# Altium schematic sheet Power.SchDoc
size B; SheetNumber: 2; SheetTotal: 7
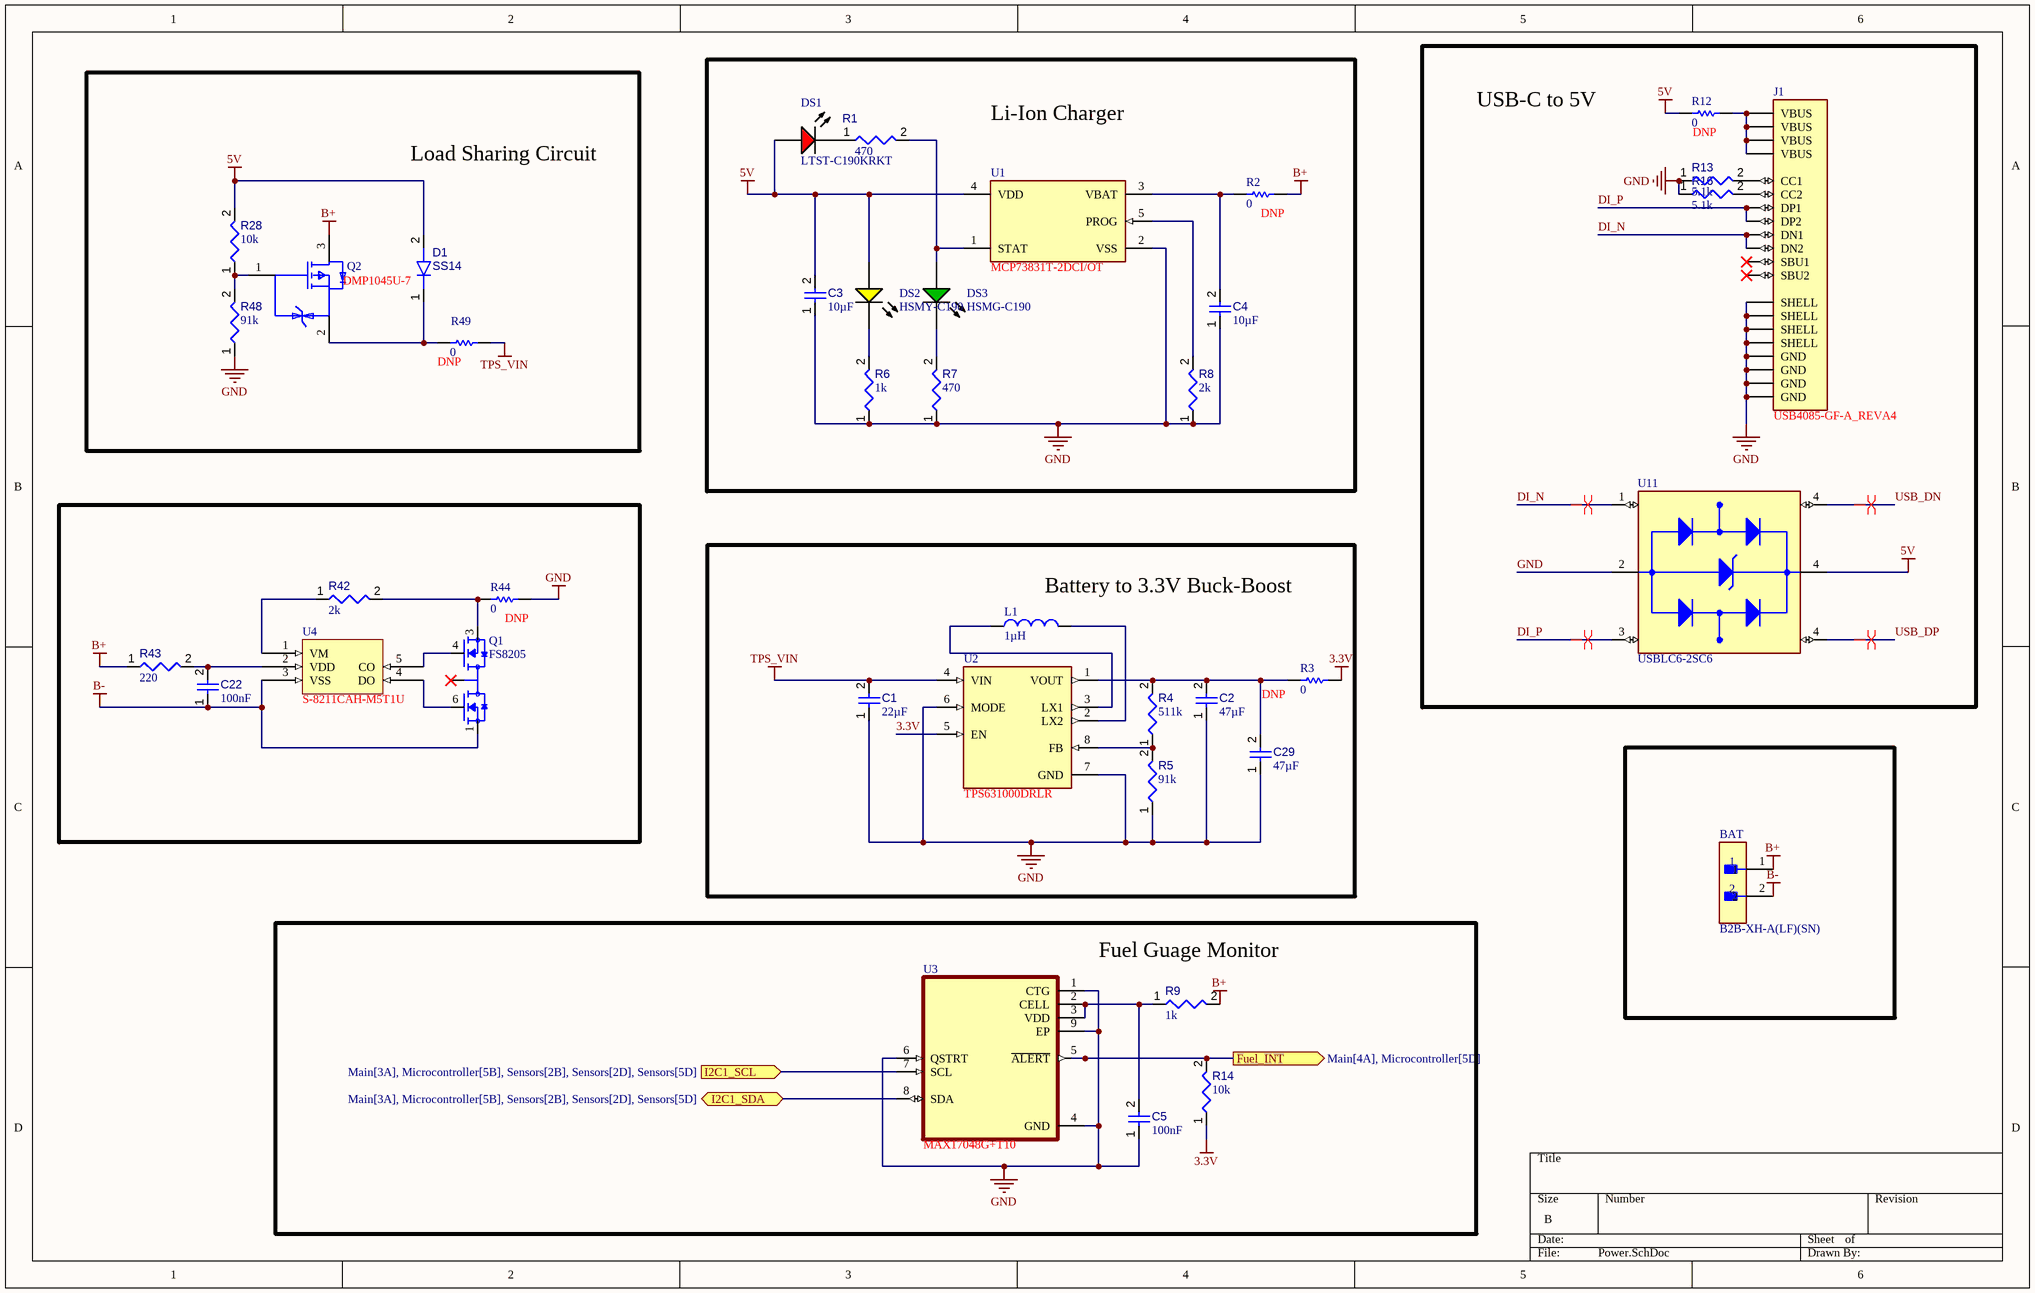
[diagram p0: Power.SchDoc]

## Parts
BAT  B2B-XH-A(LF)(SN)  [FP-B2B-XH-A_LF_SN-MFG]
C1  value 22µF  [CAPC0805(2012)145_L]  (hidden comment: Capacitor 22µF +/-40% 16V 0805)
C2  value 47µF  [FP-GRM219-0_2-0_1-IPC_B]  (hidden comment: GRM219R60J476ME44J)
C3  value 10µF  [CAPC2013X135X45NL10T25]  (hidden comment: Capacitor 10 uF +/- 10% 16 V 0805)
C4  value 10µF  [CAPC2013X135X45NL10T25]  (hidden comment: Capacitor 10 uF +/- 10% 16 V 0805)
C5  value 100nF  [CAPC2013X95X50LL10T25]  (hidden comment: Capacitor 100 nF +/-10% 50 V 0805)
C22  value 100nF  [CAPC2013X95X50LL10T25]  (hidden comment: Capacitor 100 nF +/-10% 50 V 0805)
C29  value 47µF  [FP-GRM188-0_2-IPC_C]  (hidden comment: GRM188R60J476ME15D)
D1  SS14  [FP-403AE-MFG]
DS1  LTST-C190KRKT  [LTST-C191KRKT_V]
DS2  HSMY-C190  [AVAG-HSMX-C190_V]
DS3  HSMG-C190  [AVAG-HSMX-C190_V]
J1  USB4085-GF-A_REVA4  [GCT_USB4085-GF-A_REVA4]
L1  value 1µH  [FP-DFE252012C-IPC_B]  (hidden comment: DFE252012P-1R0M=P2)
Q1  FS8205  [SOT95P280X145-6N]
Q2  DMP1045U-7  [FP-SOT23-IPC_B]
R1  value 470  [RESC0805(2012)_L]  (hidden comment: Resistor 470R +/-5% 0805 125 mW)
R2  value 0  [RESC1608X55X25ML10T15]  (hidden comment: Resistor 0R +/- 5% 0603 100 mW)
R3  value 0  [RESC1608X55X25ML10T15]  (hidden comment: Resistor 0R +/- 5% 0603 100 mW)
R4  value 511k  [RESC2013X60X35NL10T20]  (hidden comment: RC0805FR-07511KL)
R5  value 91k  [RESC2013X60X30NL20T20]  (hidden comment: RK73H2ATTD9102F)
R6  value 1k  [RESC0805(2012)_L]  (hidden comment: Resistor 1K +/-5% 0805 125 mW)
R7  value 470  [RESC0805(2012)_L]  (hidden comment: Resistor 470R +/-5% 0805 125 mW)
R8  value 2k  [RESC2013X60X35NL10T20]  (hidden comment: RT0805FRE072KL)
R9  value 1k  [RESC0805(2012)_L]  (hidden comment: Resistor 1K +/-5% 0805 125 mW)
R12  value 0  [RESC2013X60X35ML10T20]  (hidden comment: Resistor 0R +/- 5% 0805 125 mW)
R13  value 5.1k  [FP-RC2012-IPC_C]  (hidden comment: RC2012J512CS)
R14  value 10k  [RESC2013X50X35ML15T15]  (hidden comment: Resistor 10k +/-1% 0805 125 mW)
R16  value 5.1k  [FP-RC2012-IPC_C]  (hidden comment: RC2012J512CS)
R28  value 10k  [RESC2013X50X35ML15T15]  (hidden comment: Resistor 10k +/-1% 0805 125 mW)
R42  value 2k  [RESC2013X60X35NL10T20]  (hidden comment: RT0805FRE072KL)
R43  value 220  [FP-CRCW0805-e3-IPC_B]  (hidden comment: CRCW0805220RJNEA)
R44  value 0  [RESC2013X60X35ML10T20]  (hidden comment: Resistor 0R +/- 5% 0805 125 mW)
R48  value 91k  [RESC2013X60X30NL20T20]  (hidden comment: RK73H2ATTD9102F)
R49  value 0  [RESC1608X55X25ML10T15]  (hidden comment: Resistor 0R +/- 5% 0603 100 mW)
U1  MCP73831T-2DCI/OT  [FP-C04-091-OT-MFG]
U2  TPS631000DRLR  [SOT50P160X60-8N]
U3  MAX17048G+T10  [SON50P200X200X80-9N]
U4  S-8211CAH-M5T1U  [S-8211CAH-M5T1U-Footprint-1]
U11  USBLC6-2SC6  [SOT95P280X145-6N]

## Blocks framed on the sheet
Li-Ion Charger: C3 C4 DS1-DS3 R1 R2 R6-R8 U1
USB-C to 5V: J1 R12 R13 R16 U11
Load Sharing Circuit: D1 Q2 R28 R48 R49
DNP: C22 Q1 R42-R44 U4
Battery to 3.3V Buck-Boost: C1 C2 C29 L1 R3-R5 U2
Fuel Guage Monitor: C5 R9 R14 U3

## Ports
Fuel_INT (out, see Main[4A], Microcontroller[5D]), I2C1_SCL (in, see Main[3A], Microcontroller[5B], Sensors[2B], Sensors[2D], Sensors[5D]), I2C1_SDA (bidir, see Main[3A], Microcontroller[5B], Sensors[2B], Sensors[2D], Sensors[5D])

## Nets
3.3V: R3.2 R14.1 U2.5(EN)
5V: C3.2 D1.2(A) DS1.1(A) DS2.1(A) R12.2 R28.2 U1.4(VDD) U11.4(I/O2_OUT)
B+: BAT.1 Q2.3(D) R2.2 R9.2 R43.1
B-: BAT.2 C22.1 Q1.1(S1) U4.3(VSS)
GND: C1.1 C2.1 C3.1 C4.1 C5.1 C29.1 J1.A1(GND) J1.A12(GND) J1.B1(GND) J1.B12(GND) J1.S1(SHELL) J1.S2(SHELL) J1.S3(SHELL) J1.S4(SHELL) R5.1 R6.1 R7.1 R8.1 R13.1 R16.1 R44.2 R48.1 U1.2(VSS) U2.6(MODE) U2.7(GND) U3.1(CTG) U3.4(GND) U3.6(QSTRT) U3.9(EP) U11.2(GND)
TPS_VIN: C1.2 R49.2 U2.4(VIN)
DI_N: J1.A7(DN1) J1.B7(DN2) U11.1(I/O1_IN)
DI_P: J1.A6(DP1) J1.B6(DP2) U11.3(I/O2_IN)
Fuel_INT: R14.2 U3.5(~{ALERT}) ; port Fuel_INT
I2C1_SCL: U3.7(SCL) ; port I2C1_SCL
I2C1_SDA: U3.8(SDA) ; port I2C1_SDA
USB_DN: U11.4(I/O2_OUT)
USB_DP: U11.4(I/O2_OUT)
NetC2_2: C2.2 C29.2 R3.1 R4.2 U2.1(VOUT)
NetC4_2: C4.2 R2.1 U1.3(VBAT)
NetC5_2: C5.2 R9.1 U3.2(CELL) U3.3(VDD)
NetC22_2: C22.2 R43.2 U4.2(VDD)
NetD1_1: D1.1(K) Q2.2(S) R49.1
NetDS1_2: DS1.2(K) R1.1
NetDS2_2: DS2.2(K) R6.2
NetDS3_1: DS3.1(A) R1.2 U1.1(STAT)
NetDS3_2: DS3.2(K) R7.2
NetJ1_A4: J1.A4(VBUS) J1.A9(VBUS) J1.B4(VBUS) J1.B9(VBUS) R12.1
NetJ1_A5: J1.A5(CC1) R13.2
NetJ1_B5: J1.B5(CC2) R16.2
NetL1_1: L1.1 U2.3(LX1)
NetL1_2: L1.2 U2.2(LX2)
NetQ1_2: Q1.2(D12) Q1.5(D12)
NetQ1_3: Q1.3(S2) R42.2 R44.1
NetQ1_4: Q1.4(G2) U4.5(CO)
NetQ1_6: Q1.6(G1) U4.4(DO)
NetQ2_1: Q2.1(G) R28.1 R48.2
NetR4_1: R4.1 R5.2 U2.8(FB)
NetR8_2: R8.2 U1.5(PROG)
NetR42_1: R42.1 U4.1(VM)

Not connected (* = marked no-connect by the designer): J1 A8(SBU1)* B8(SBU2)*

## Layout directives
differential pair; net class DI; differential pair class DI: DI_N
differential pair; differential pair class DI; net class DI: DI_P
differential pair; net class DO; differential pair class DO: USB_DN, USB_DP

## Notes on the sheet
- (near R12) DNP
- (near R2) DNP
- (near R49) DNP
- (near R3) DNP

## Library data of the parts
BAT = CMP-002-00073-1: CONNECTOR HEADER, XH SERIES, 2 POSITION, 2.50MM, Press-Fit Solder, Detent Lock, Natural; Max Current Rating: 3A; Voltage Rating: 250V; Connector Type: Male Pin; Max Operating Temperature: 85°C; Min Operating Temperature: -25°C; Mounting Technology: Through Hole; Pins: 2; Manufacturer Part Number 1: B2B-XH-A(LF)(SN)
C1 = CMP-001-00081-4: Chip Capacitor, 22µF +/-40%, 16V, 0805, Thickness 1.45 mm; Tolerance: 5%; Voltage Rating: 16V; Mounting Technology: SMT; Pins: 2; Max Operating Temperature: 85°C; Case/Package: 0805; Min Operating Temperature: -55°C; LCSC ID: C162295
C2 = CMP-001-00086-1: Ceramic Capacitor, Multilayer, Ceramic, 6.3V, 20% +Tol, 20% -Tol, X5R, 15% TC, 47uF, Surface Mount, 2012M/0805; Max Operating Temperature: 85°C; Tolerance: 20%; Mounting Technology: Surface Mount; Voltage Rating: 6.3V; Min Operating Temperature: -55°C; Case/Package: 0805
C3 C4 = CMP-001-00015-6: Chip Capacitor, 10 uF, +/- 10%, 16 V, 0805 (2012 Metric); Voltage Rating: 16V; Capacitor Type: Ceramic; RoHS Compliant: True; Max Operating Temperature: 85°C; Min Operating Temperature: -55°C; Mounting Technology: SM; Tolerance: 10%; Case/Package: 0805; Pins: 2
  C3: LCSC ID: C77075
C5 C22 = CMP-001-00018-6: Chip Capacitor, 100 nF, +/- 10%, 50 V, 0805 (2012 Metric); Capacitor Type: Ceramic; Voltage Rating: 50V; Pins: 2; Max Operating Temperature: 125°C; Min Operating Temperature: -55°C; Mounting Technology: SM; Case/Package: 0805; RoHS Compliant: True; Tolerance: 10%
C29 = CMP-001-00088-1: 6.3V 47uF X5R ±20% 0603 Multilayer Ceramic Capacitors MLCC - SMD/SMT ROHS; Case/Package: 0603; Tolerance: 20%; Voltage Rating: 6.3V; Mounting Technology: Surface Mount; Min Operating Temperature: -55°C; Max Operating Temperature: 85°C
D1 = CMP-004-00032-1: SS14 Series 500 mV 1 A 40 V Max Reverse Voltage Schottky Rectifier - DO-214AC; Forward Voltage: 500mV; Forward Current: 1A; Mounting Technology: Surface Mount; Max Operating Temperature: 125°C; Pins: 2; Min Operating Temperature: -65°C; Case/Package: SMA
DS1 = CMP-007-00024-2: LED Uni-Color Red, 62.5 mW, 25 mA, -30 to 85 degC, 2-Pin SMD, RoHS, Tape and Reel; Manufacturer: Lite-On; Power: 75mW; Forward Voltage: 2V; Luminous Intensity: 54mcd; Lens Style: Diffused; Viewing Angle: 130degrees; Forward Current: 20mA; Manufacturer URL: http://www.us.liteon.com/; Case/Package: 0603; Datasheet Version: Rev. F, 05/2013; Package Reference: C191KRKT; Datasheet URL: http://optoelectronics.liteon.com/upload/download/DS-22-99-0151/S_110_LTST-C190KRKT.pdf; Package Description: 2-Pin Surface Mount Device, Body 1.6 x 0.8 mm; Nominal Vf: 2V; Packaging: TapeandReel; RoHS Compliant: True; Pins: 2; Illumination Colour: Red; Colour: Red; Mounting Technology: SM; Package Quantity: 3000; Min Operating Temperature: -55°C; Max Operating Temperature: 85°C
DS2 = CMP-007-00017-2: LED Uni-Color Yellow, 65 mW, 20 mA, -40 to 85 degC, 2-Pin SMD, RoHS, Tape and Reel; Manufacturer: Avago; Forward Current: 20mA; Viewing Angle: 170degrees; Power: 52mW; Lens Style: Diffused; Nominal Vf: 2.1V; Luminous Intensity: 8mcd; Max Operating Temperature: 85°C; Package Quantity: 4000; Package Description: 2-Pin Surface Mount Device, Body 1.6 x 0.8 mm, Height 0.9 mm; Packaging: TapeandReel; Case/Package: 0603; Datasheet Version: Mar-12; Min Operating Temperature: -40°C; Pins: 2; Illumination Colour: Yellow; Package Reference: HSMX-C190; Colour: Yellow; Manufacturer URL: http://www.avagotech.com/; Datasheet URL: http://docs.avagotech.com/docs/AV02-0551EN; Forward Voltage: 2.1V; RoHS Compliant: True; Mounting Technology: SM
DS3 = CMP-007-00013-2: LED Uni-Color Green, 52 mW, 20 mA, -40 to 85 degC, 2-Pin SMD, RoHS, Tape and Reel; Manufacturer: Avago; Forward Current: 20mA; Viewing Angle: 170degrees; Luminous Intensity: 15mcd; Lens Style: Diffused; Forward Voltage: 2.2V; Power: 52mW; Mounting Technology: SM; RoHS Compliant: True; Packaging: TapeandReel; Illumination Colour: Green; Datasheet URL: http://docs.avagotech.com/docs/AV02-0551EN; Min Operating Temperature: -40°C; Max Operating Temperature: 85°C; Pins: 2; Package Description: 2-Pin Surface Mount Device, Body 1.6 x 0.8 mm, Height 0.9 mm; Nominal Vf: 2.2V; Case/Package: 0603; Manufacturer URL: http://www.avagotech.com/; Datasheet Version: Mar-12; Colour: Green; Package Reference: HSMX-C190; Package Quantity: 4000
J1 = CMP-002-00071-1: USB-C (USB TYPE-C) USB 2.0 Receptacle Connector 24 (16+8 Dummy) Position Through Hole, Right Angle, low cost, 3.46mm profile, 16 pin, horizontal, Top mount; MF: Global Connector Technology; SnapEDA_Link: https://www.snapeda.com/parts/USB4085-GF-A/Global+Connector+Technology/view-part/?ref=snap; Value: *; Component Type: Standard; Design Item ID: USB4085-GF-A_REVA4; MP: USB4085-GF-A; Check_prices: https://www.snapeda.com/parts/USB4085-GF-A/Global+Connector+Technology/view-part/?ref=eda; Availability: In Stock; Case/Package: None; Source: USB4085-GF-A_REVA4.SchLib; Purchase-URL: https://pricing.snapeda.com/search/part/USB4085-GF-A/?ref=eda; Price: None; Pins: 20; Manufacturer Part Number 1: USB4085-GF-A_REVA4
L1 = CMP-006-00021-1: Inductor Power Shielded Wirewound 1uH 20% 1MHz Metal Alloy 3.2A 0.042Ohm DCR 1008 T/R; Current Rating: 3.2A; Tolerance: 20%; Case/Package: 1008; Min Operating Temperature: -40°C; Max Operating Temperature: 125°C; Max Current Rating: 3.2A; Mounting Technology: Surface Mount; Manufacturer Part Number 1: DFE252012P-1R0M=P2
Q1 = CMP-019-00049-1: ÐœÐžÐŸ-Ñ‚Ñ€Ð°Ð½Ð·Ð¸ÑÑ‚Ð¾Ñ€ Ñ Ð´Ð²Ð¾Ð¹Ð½Ñ‹Ð¼ N-ÐºÐ°Ð½Ð°Ð»ÑŒÐ½Ñ‹Ð¼ Ñ€ÐµÐ¶Ð¸Ð¼Ð¾Ð¼ ÑƒÑÐ¸Ð»ÐµÐ½Ð¸Ñ Ð¼Ð¾Ñ‰Ð½Ð¾ÑÑ‚Ð¸; MF: Fortune Semiconductor; Source: FS8205.SchLib; Case/Package: Package; MP: FS8205; Value: *; Check_prices: https://www.snapeda.com/parts/FS8205/Fortune+Semiconductor/view-part/?ref=eda; Design Item ID: FS8205; Pins: 6; SnapEDA_Link: https://www.snapeda.com/parts/FS8205/Fortune+Semiconductor/view-part/?ref=snap; Component Type: Standard; Manufacturer Part Number 1: FS8205
Q2 = CMP-019-00050-1: P-Channel 12 V 31 mOhm Surface Mount Enhancement Mode Mosfet - SOT-23-3; Max Power Dissipation: 1.3W; Pins: 3; Min Operating Temperature: -55°C; Max Operating Temperature: 150°C; Mounting Technology: Surface Mount; Case/Package: SOT-23-3
R1 R7 = CMP-009-00122-3: Chip Resistor, 470 Ohms, +/-5%, 125 mW, -55 to 155 degC, 0805; Tolerance: 5%; Power: 125mW; Max Operating Temperature: 155°C; Case/Package: 0805; Pins: 2; Min Operating Temperature: -55°C
  R7: LCSC ID: C2073861
R2 R3 R49 = CMP-009-00006-5: Chip Resistor, 0 Ohm, 0.1 W, -55 to 155 degC, 0603 (1608 Metric); Power: 100mW; Voltage Rating: 50V; Max Operating Temperature: 155°C; RoHS Compliant: True; Mounting Technology: SM; Case/Package: 0603; Min Operating Temperature: -55°C; Tolerance: 5%; Pins: 2
R4 = CMP-009-00177-1: Res Thick Film 0805 511K Ohm 1% 0.125W(1/8W) ±100ppm/C Pad SMD T/R; Voltage Rating: 150V; Tolerance: 1%; Case/Package: 0805; Min Operating Temperature: -55°C; Mounting Technology: Surface Mount; Max Operating Temperature: 155°C; LCSC ID: C137511
R5 R48 = CMP-009-00181-1: Res Thick Film 0805 91K Ohm 1% 0.25W(1/4W) ±100ppm/C Pad SMD T/R Automotive AEC-Q200; Voltage Rating: 150V; Case/Package: 0805; Mounting Technology: Surface Mount; Min Operating Temperature: -55°C; Pins: 2; Max Operating Temperature: 155°C; Tolerance: 1%; LCSC ID: C317292
R6 R9 = CMP-009-00118-3: Chip Resistor, 1 kOhms, +/-5%, 125 mW, -55 to 155 degC, 0805; Tolerance: 5%; Power: 125mW; Case/Package: 0805; Pins: 2; Min Operating Temperature: -55°C; Max Operating Temperature: 155°C
  R6: LCSC ID: C100046
R8 R42 = CMP-009-00183-1: 125mW Thin Film Resistor 150V ±50ppm/℃ ±1% 2kΩ 0805 Chip Resistor - Surface Mount ROHS; Min Operating Temperature: -55°C; Mounting Technology: Surface Mount; Max Operating Temperature: 155°C; Case/Package: 0805; Tolerance: 1%; Voltage Rating: 150V
R12 R44 = CMP-009-00007-5: Chip Resistor, 0 Ohm, 0.125 W, -55 to 155 degC, 0805 (2012 Metric); Power: 125mW; Voltage Rating: 50V; RoHS Compliant: True; Max Operating Temperature: 155°C; Case/Package: 0805; Mounting Technology: SM; Min Operating Temperature: -55°C; Tolerance: 5%; Pins: 2
R13 R16 = CMP-009-00184-1: Res Thick Film 0805 5.1K Ohm 5% 0.125W(1/8W) ±100ppm/C Pad SMD T/R; Voltage Rating: 150V; Min Operating Temperature: -55°C; Case/Package: 0805; Mounting Technology: Surface Mount; Max Operating Temperature: 155°C; Tolerance: 5%
R14 R28 = CMP-009-00018-5: Chip Resistor, 10 KOhm, +/- 1%, 125 mW, -55 to 155 degC, 0805 (2012 Metric); Power: 125mW; Voltage Rating: 150V; Tolerance: 1%; Pins: 2; Min Operating Temperature: -55°C; Case/Package: 0805; Max Operating Temperature: 155°C; RoHS Compliant: True; Mounting Technology: SM
R43 = CMP-009-00178-1: Fixed Resistor, Metal Glaze/Thick Film, 0.125W, 220ohm, 150V, 5% +/-Tol, Surface Mount, 0805; Case/Package: 0805; Voltage Rating: 150V; Mounting Technology: Surface Mount; Min Operating Temperature: -55°C; Max Operating Temperature: 155°C; Pins: 2; Tolerance: 5%
U1 = CMP-019-00053-1: Linear Battery Charger Controller Li-Ion/Li-Pol 505mA 4.2V 5-Pin SOT-23 T/R; Min Supply Voltage: 3.75V; Output Current: 500mA; Max Supply Voltage: 6V; Mounting Technology: Surface Mount; Pins: 5; Case/Package: SOT-23-5; Max Operating Temperature: 85°C; Min Operating Temperature: -40°C; Output Voltage: 4.2V
U2 = CMP-003-000000-1: 1.5-A output current, high-power-density buck-boost converter; MF: Texas Instruments; Component Type: Standard; Source: TPS631000DRLR.SchLib; Pin Count: 8; MP: TPS631000DRLR; Design Item ID: TPS631000DRLR; Check_prices: https://www.snapeda.com/parts/TPS631000DRLR/Texas+Instruments/view-part/?ref=eda; SnapEDA_Link: https://www.snapeda.com/parts/TPS631000DRLR/Texas+Instruments/view-part/?ref=snap; Value: *; Package: SOT-583 Texas Instruments; LCSC ID: C5219190; Manufacturer Part Number 1: TPS631000DRLR
U3 = CMP-019-00054-1: 3ÂµA 1-Cell/2-Cell Fuel Gauge with ModelGauge; MF: Analog Devices; Pins: 9; Value: *; Case/Package: TDFN-8 Maxim; Design Item ID: MAX17048G+T10; Source: MAX17048G+T10.SchLib; MP: MAX17048G+T10; Check_prices: https://www.snapeda.com/parts/MAX17048G+T10/Analog+Devices/view-part/?ref=eda; Component Type: Standard; SnapEDA_Link: https://www.snapeda.com/parts/MAX17048G+T10/Analog+Devices/view-part/?ref=snap; Purchase-URL: https://pricing.snapeda.com/search/part/MAX17048G+T10/?ref=eda; Price: None; Availability: In Stock; Manufacturer Part Number 1: MAX17048G+T10
U4 = CMP-019-00055-1: Battery Protector Li-Ion/Li-Pol Over Charge/Over Discharge/Over Current 1-Cell Pack 5-Pin SOT-23 T/R; Min Supply Voltage: 1.5V; Max Supply Voltage: 8V; Min Operating Temperature: -40°C; Case/Package: LSSOP; Max Operating Temperature: 85°C
U11 = CMP-004-00033-1: 17V Clamp 5A (8/20Âµs) Ipp Tvs Diode Surface Mount SOT-23-6; MF: STMicroelectronics; Design Item ID: USBLC6-2SC6; Component Type: Standard; MP: USBLC6-2SC6; Source: USBLC6-2SC6.SchLib; Value: *; Purchase-URL: https://pricing.snapeda.com/search/part/USBLC6-2SC6/?ref=eda; Price: None; Availability: In Stock; SnapEDA_Link: https://www.snapeda.com/parts/USBLC6-2SC6/STMicroelectronics/view-part/?ref=snap; Case/Package: SOT-23-6 STMicroelectronics; Check_prices: https://www.snapeda.com/parts/USBLC6-2SC6/STMicroelectronics/view-part/?ref=eda; Pins: 6; Manufacturer Part Number 1: USBLC6-2SC6